# EAGLE design Charger_PCB (EAGLE 6.6.0)

## Sheet 1 of 2
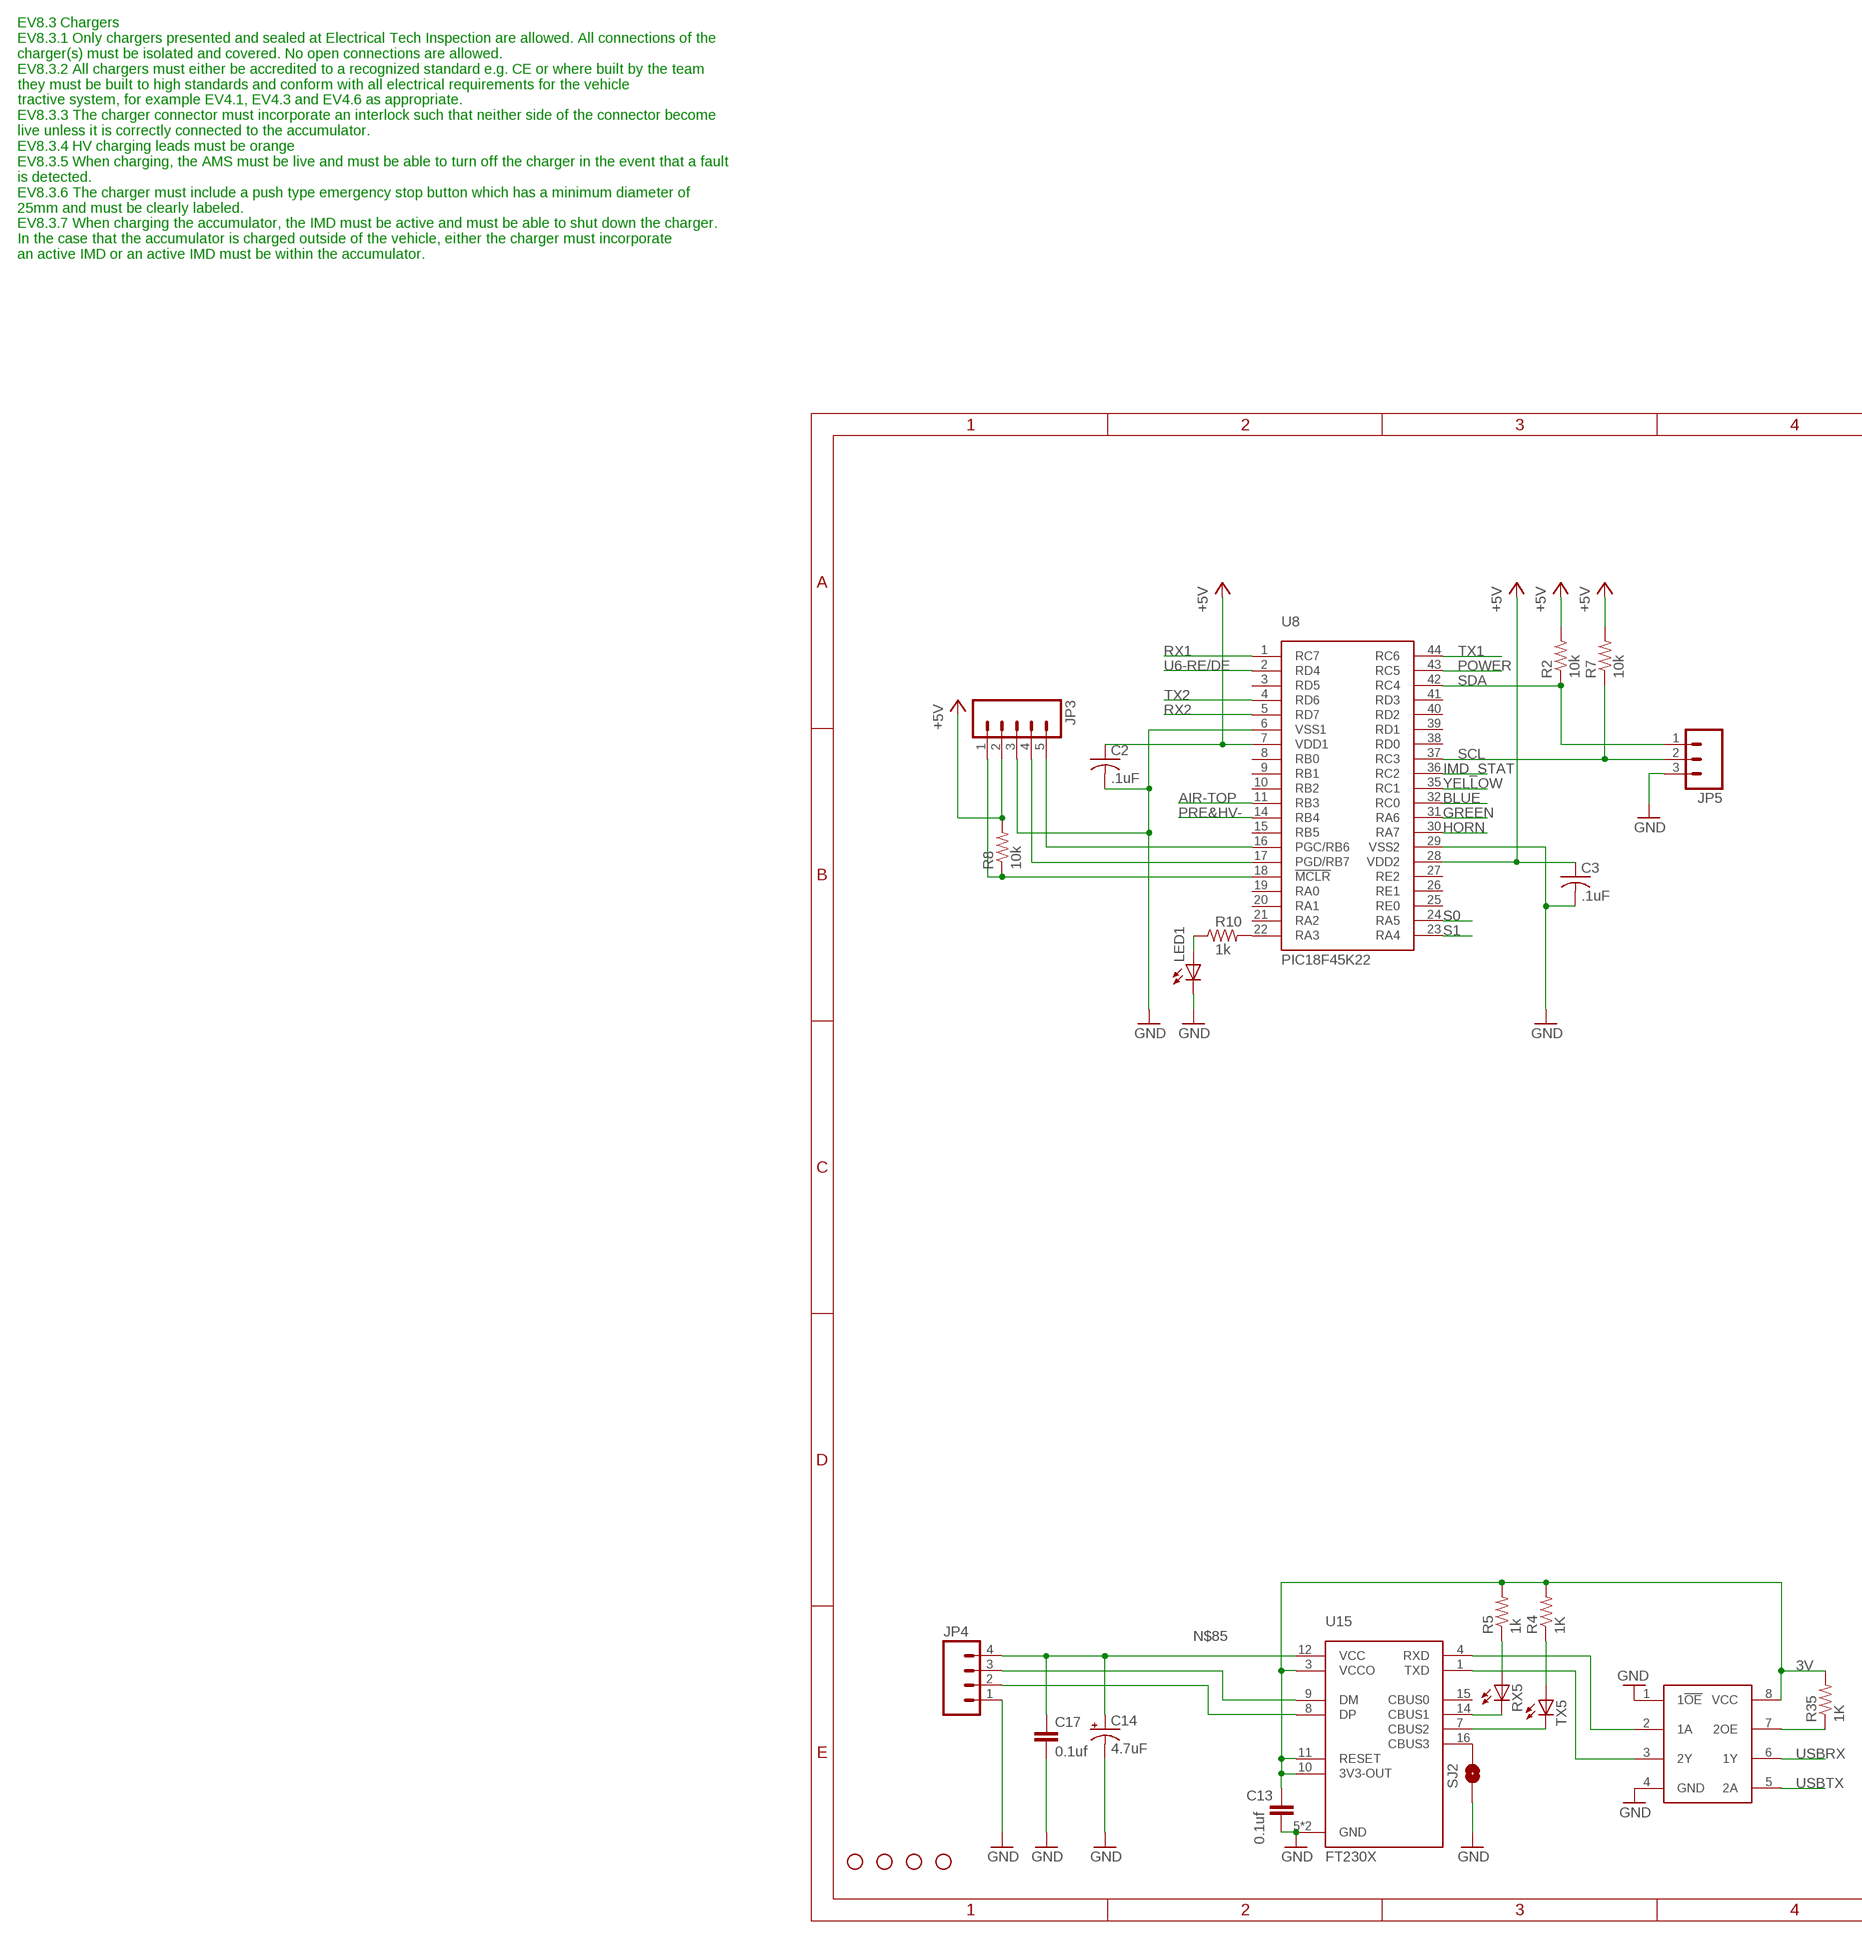
[diagram p0: schematic, sheet 1, part 1 of 2]
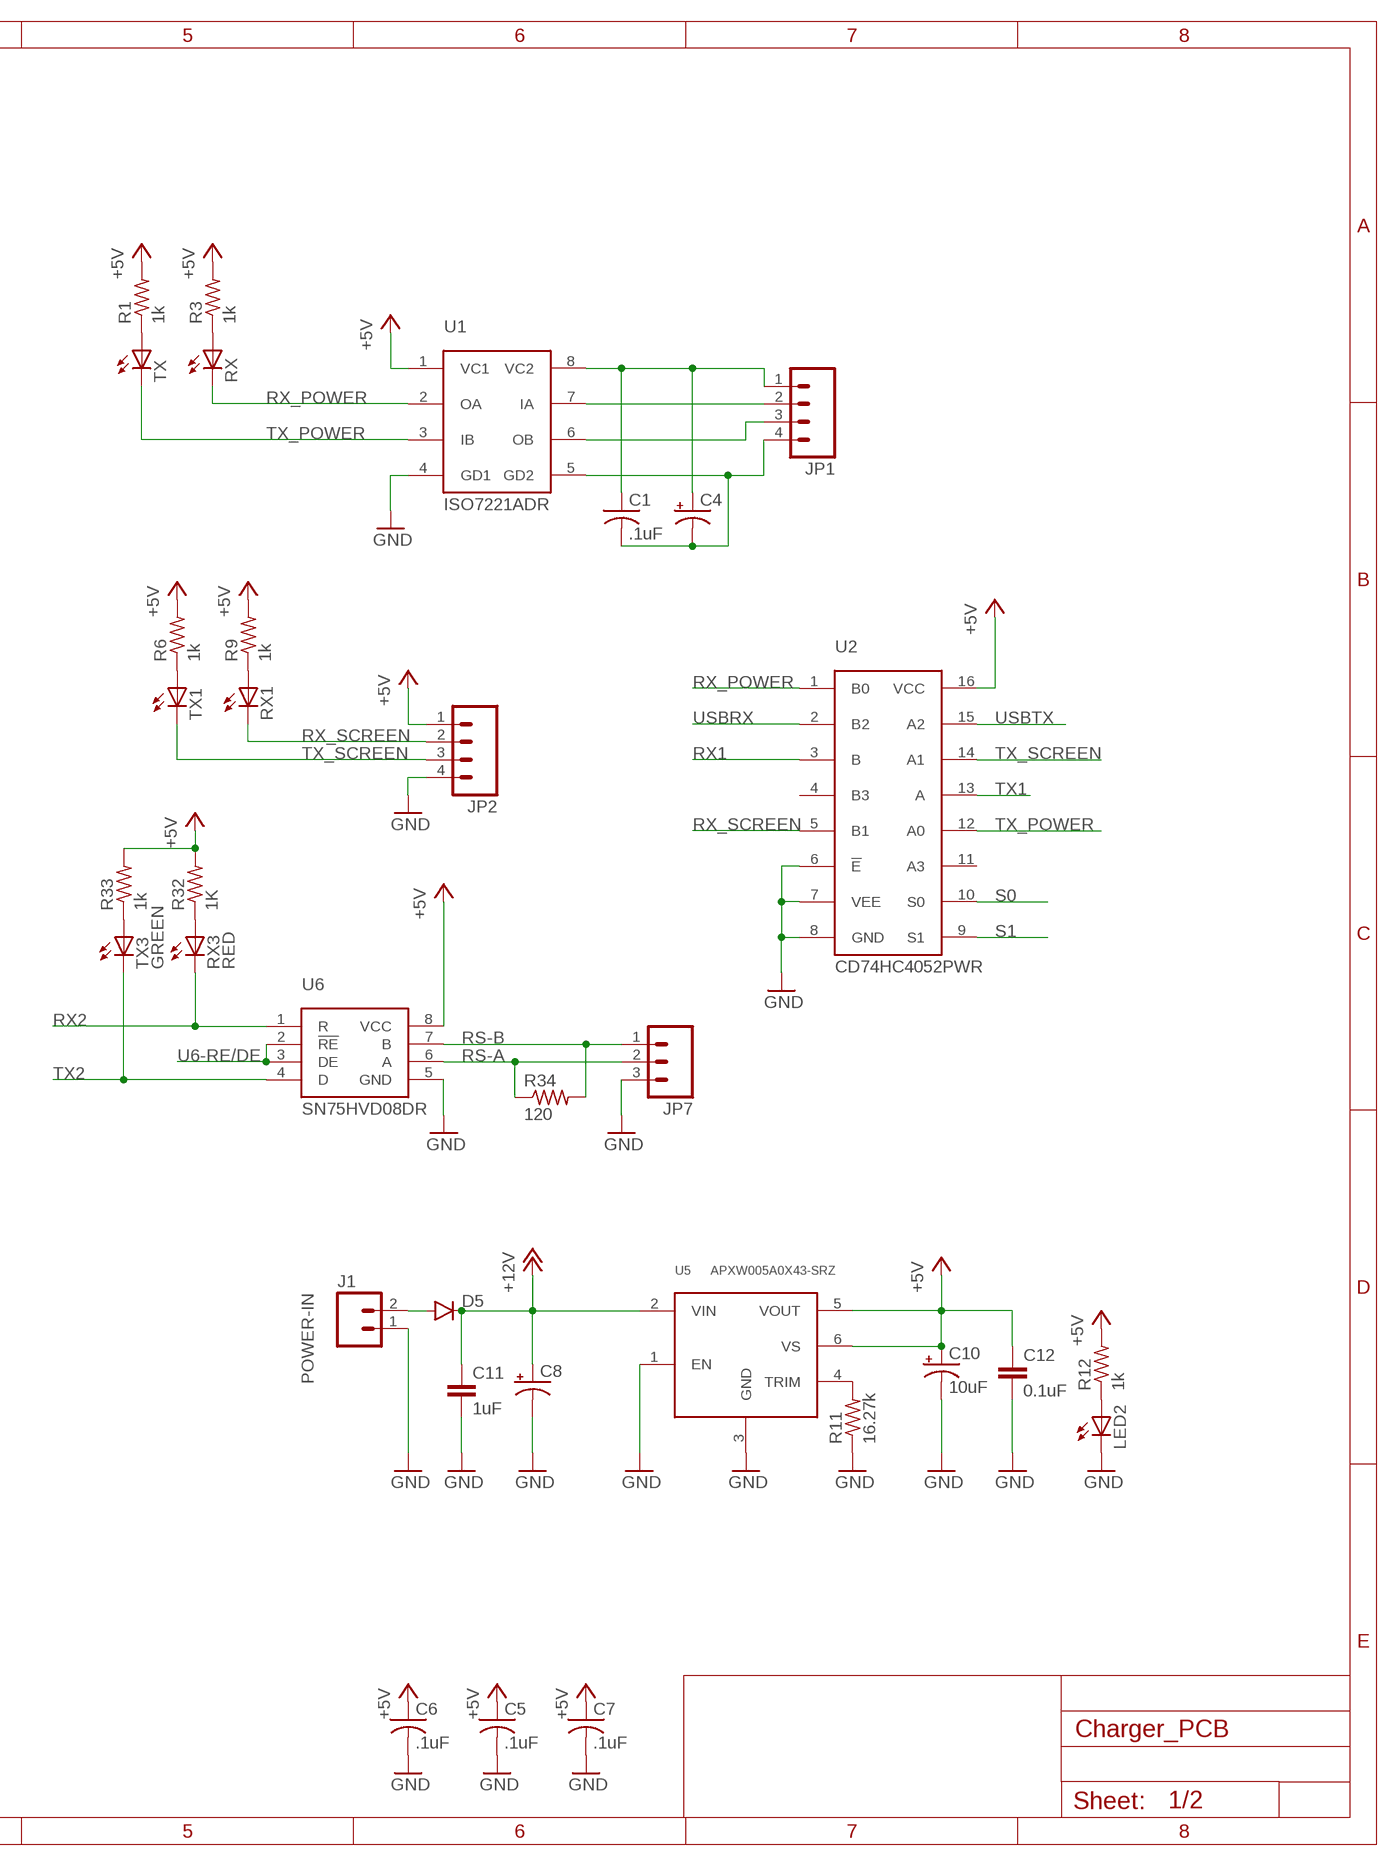
[diagram p1: schematic, sheet 1, part 2 of 2]

### Parts
C1  .1uF  C-USC0805  [C0805]
C2  .1uF  C-USC0805  [C0805]
C3  .1uF  C-USC0805  [C0805]
C4  CAP_POL1206-KIT  [EIA3216-KIT]
C5  .1uF  C-USC0805  [C0805]
C6  .1uF  C-USC0805  [C0805]
C7  .1uF  C-USC0805  [C0805]
C8  CAP_POLE  [PANASONIC_E]
C10  10uF  CAP_POL6032  [EIA6032]
C11  1uF  CAP1206  [1206]
C12  0.1uF  CAP0805  [0805]
C13  0.1uf  CAP0805  [0805]
C14  4.7uF  CAP_POL1206  [EIA3216]
C17  0.1uf  CAP0805  [0805]
D5  DIODEHV  [DIODE-HV]
J1  POWER-IN  EUROMAG-290DEG  [M2]
JP1  M04POLAR_LOCK  [MOLEX-1X4_LOCK]
JP2  M04POLAR_LOCK  [MOLEX-1X4_LOCK]
JP3  M05LOCK_LONGPADS  [1X05_LOCK_LONGPADS]
JP4  M04POLAR_LOCK  [MOLEX-1X4_LOCK]
JP5  M03POLAR_LOCK  [MOLEX-1X3_LOCK]
JP7  M03POLAR_LOCK  [MOLEX-1X3_LOCK]
LED1  LEDCHIP-LED0805  [CHIP-LED0805]
LED2  LEDCHIPLED_0805  [CHIPLED_0805]
R1  1k  R-US_R0805  [R0805]
R2  10k  R-US_R0805  [R0805]
R3  1k  R-US_R0805  [R0805]
R4  1K  R-US_R0805  [R0805]
R5  1k  R-US_R0805  [R0805]
R6  1k  R-US_R0805  [R0805]
R7  10k  R-US_R0805  [R0805]
R8  10k  RESISTOR0805-RES  [0805]
R9  1k  R-US_R0805  [R0805]
R10  1k  R-US_R0805  [R0805]
R11  16.27k  R-US_R0805  [R0805]
R12  1k  R-US_R0805  [R0805]
R32  1K  R-US_R0805  [R0805]
R33  1k  R-US_R0805  [R0805]
R34  120  R-US_R0805  [R0805]
R35  1K  R-US_R0805  [R0805]
RX  LEDCHIPLED_0805  [CHIPLED_0805]
RX1  LEDCHIPLED_0805  [CHIPLED_0805]
RX3  RED  LEDCHIPLED_0805  [CHIPLED_0805]
RX5  LEDCHIPLED_0805  [CHIPLED_0805]
SJ2  JUMPER-PAD-2-NOYES_SILK  [PAD-JUMPER-2-NO_YES_SILK]
STANDOFF1  STAND-OFF  [STAND-OFF]
STANDOFF2  STAND-OFF  [STAND-OFF]
STANDOFF3  STAND-OFF  [STAND-OFF]
STANDOFF4  STAND-OFF  [STAND-OFF]
TX  LEDCHIPLED_0805  [CHIPLED_0805]
TX1  LEDCHIPLED_0805  [CHIPLED_0805]
TX3  GREEN  LEDCHIPLED_0805  [CHIPLED_0805]
TX5  LEDCHIPLED_0805  [CHIPLED_0805]
U1  ISO7221ADR  [SO08]
U2  CD74HC4052PWR  [TSSOP-16]
U4  SN74LVC2G241DCTR  [VFSOP-8]
U5  APXW005A0X43-SRZ  [APXW005A0X43-SRZ]
U6  SN75HVD08DR  [SO-8]
U8  PIC18F45K22  [TQFP-44]
U15  FT230X  [SSOP-16]

### Nets
3V: C13.1 R4.2 R5.2 R35.2 U4.8(VCC) U15.3(VCCO) U15.10(3V3-OUT) U15.11(RESET)
+5V: C2.1 C3.1 C5.1 C6.1 C7.1 C10.P$1(+) C12.1 JP2.1 JP3.2 R1.2 R2.2 R3.2 R6.2 R7.2 R8.2 R9.2 R12.2 R32.2 R33.2 U1.1(VC1) U2.16(VCC) U5.5(VOUT) U5.6(VS) U6.8(VCC) U8.7(VDD1) U8.28(VDD2) ; also sheet 2
+12V: C8.+ C11.1 D5.C U5.2(VIN) ; also sheet 2
AIR-TOP: U8.11(RB3) ; also sheet 2
BLUE: U8.32(RC0) ; also sheet 2
GND: C2.2 C3.2 C5.2 C6.2 C7.2 C8.- C10.P$2(-) C11.2 C12.2 C13.2 C14.C(-) C17.2 J1.1 JP2.4 JP3.3 JP4.1 JP5.3 JP7.3 LED1.C LED2.C R11.1 SJ2.1 U1.4(GD1) U2.6(!E) U2.7(VEE) U2.8(GND) U4.1(1!OE) U4.4(GND) U5.1(EN) U5.3(GND) U6.5(GND) U8.6(VSS1) U8.29(VSS2) U15.5(GND) U15.13(GND) ; also sheet 2
GREEN: U8.31(RA6) ; also sheet 2
HORN: U8.30(RA7) ; also sheet 2
IMD_STAT: U8.36(RC2) ; also sheet 2
N$1: LED1.A R10.1
N$2: R10.2 U8.22(RA3)
N$3: C1.1 C4.A(+) JP1.1 U1.8(VC2)
N$4: JP1.2 U1.7(IA)
N$5: JP1.3 U1.6(OB)
N$6: C1.2 C4.C(-) JP1.4 U1.5(GD2)
N$7: R1.1 TX.A
N$8: R3.1 RX.A
N$9: R4.1 TX5.A
N$10: R5.1 RX5.A
N$11: R6.1 TX1.A
N$12: R9.1 RX1.A
N$16: R11.2 U5.4(TRIM)
N$19: LED2.A R12.1
N$35: R33.1 TX3.A
N$36: TX5.C U15.7(CBUS2)
N$37: R32.1 RX3.A
N$38: RX5.C U15.14(CBUS1)
N$39: U4.2(1A) U15.4(RXD)
N$40: JP3.4 U8.17(PGD/RB7)
N$41: U4.3(2Y) U15.1(TXD)
N$42: JP4.3 U15.9(DM)
N$43: JP3.5 U8.16(PGC/RB6)
N$45: D5.A J1.2
N$46: JP3.1 R8.1 U8.18(!MCLR)
N$54: JP4.2 U15.8(DP)
N$62: SJ2.2 U15.16(CBUS3)
N$69: R35.1 U4.7(2OE)
N$85: C14.A(+) C17.1 JP4.4 U15.12(VCC)
POWER: U8.43(RC5) ; also sheet 2
PRE&HV-: U8.14(RB4) ; also sheet 2
RS-A: JP7.2 R34.1 U6.6(A)
RS-B: JP7.1 R34.2 U6.7(B)
RX1: U2.3(B) U8.1(RC7)
RX2: RX3.C U6.1(R) U8.5(RD7)
RX_POWER: RX.C U1.2(OA) U2.1(B0)
RX_SCREEN: JP2.2 RX1.C U2.5(B1)
S0: U2.10(S0) U8.24(RA5)
S1: U2.9(S1) U8.23(RA4)
SCL: JP5.2 R7.1 U8.37(RC3)
SDA: JP5.1 R2.1 U8.42(RC4)
TX1: U2.13(A) U8.44(RC6)
TX2: TX3.C U6.4(D) U8.4(RD6)
TX_POWER: TX.C U1.3(IB) U2.12(A0)
TX_SCREEN: JP2.3 TX1.C U2.14(A1)
U6-RE/DE: U6.2(!RE) U6.3(DE) U8.2(RD4)
USBRX: U2.2(B2) U4.6(1Y)
USBTX: U2.15(A2) U4.5(2A)
YELLOW: U8.35(RC1) ; also sheet 2
Unconnected: U2.4(B3) U2.11(A3) U8.3(RD5) U8.8(RB0) U8.9(RB1) U8.10(RB2) U8.15(RB5) U8.19(RA0) U8.20(RA1) U8.21(RA2) U8.25(RE0) U8.26(RE1) U8.27(RE2) U8.38(RD0) U8.39(RD1) U8.40(RD2) U8.41(RD3) U15.15(CBUS0)

### Notes on the sheet
- EV8.3 Chargers
  EV8.3.1 Only chargers presented and sealed at Electrical Tech Inspection are allowed. All connections of the 
  charger(s) must be isolated and covered. No open connections are allowed.
  EV8.3.2 All chargers must either be accredited to a recognized standard e.g. CE or where built by the team 
  they must be built to high standards and conform with all electrical requirements for the vehicle 
  tractive system, for example EV4.1, EV4.3 and EV4.6 as appropriate.
  EV8.3.3 The charger connector must incorporate an interlock such that neither side of the connector become 
  live unless it is correctly connected to the accumulator.
  EV8.3.4 HV charging leads must be orange
  EV8.3.5 When charging, the AMS must be live and must be able to turn off the charger in the event that a fault 
  is detected.
  EV8.3.6 The charger must include a push type emergency stop button which has a minimum diameter of 
  25mm and must be clearly labeled.
  EV8.3.7 When charging the accumulator, the IMD must be active and must be able to shut down the charger. 
  In the case that the accumulator is charged outside of the vehicle, either the charger must incorporate 
  an active IMD or an active IMD must be within the accumulator.

## Sheet 2 of 2
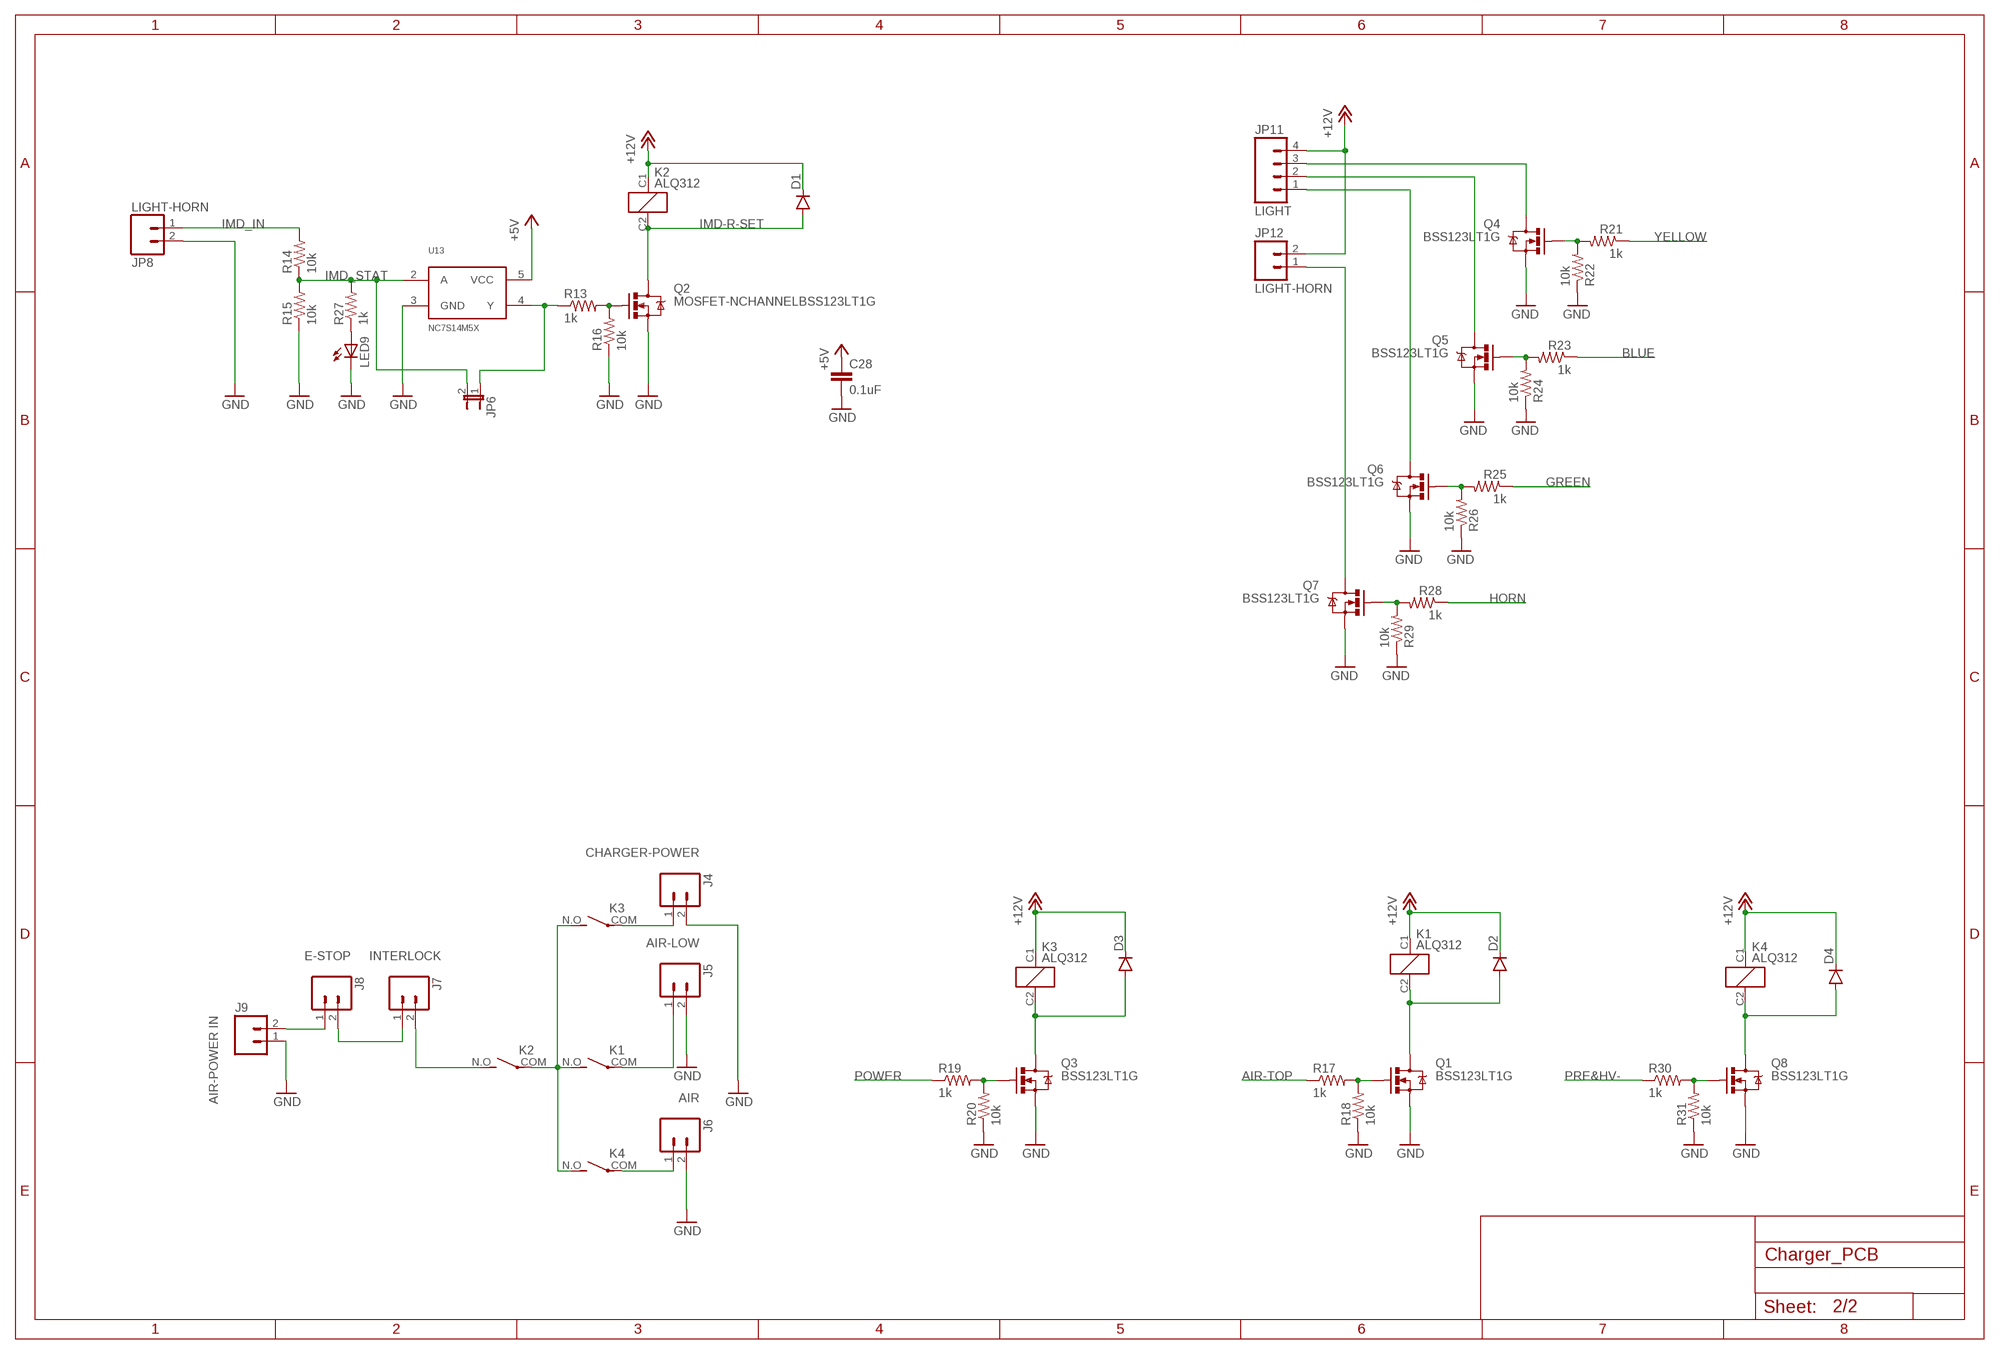
[diagram p2: schematic, sheet 2]

### Parts
C28  0.1uF  CAP0805  [0805]
D1  DIODEHV  [DIODE-HV]
D2  DIODEHV  [DIODE-HV]
D3  DIODEHV  [DIODE-HV]
D4  DIODEHV  [DIODE-HV]
J4  CHARGER-POWER  EUROMAG-290DEG  [M2]
J5  AIR-LOW  EUROMAG-290DEG  [M2]
J6  AIR  EUROMAG-290DEG  [M2]
J7  INTERLOCK  EUROMAG-290DEG  [M2]
J8  E-STOP  EUROMAG-290DEG  [M2]
J9  AIR-POWER IN  EUROMAG-290DEG  [M2]
JP6  JUMPER-2SMD-NO  [SJ_2S-NO]
JP8  LIGHT-HORN  M02POLAR_LOCK  [MOLEX-1X2_LOCK]
JP11  LIGHT  M04POLAR_LOCK  [MOLEX-1X4_LOCK]
JP12  LIGHT-HORN  M02POLAR_LOCK  [MOLEX-1X2_LOCK]
K1  ALQ312  [ALQ312]
K2  ALQ312  [ALQ312]
K3  ALQ312  [ALQ312]
K4  ALQ312  [ALQ312]
LED9  LEDCHIPLED_0805  [CHIPLED_0805]
Q1  BSS123LT1G  MOSFET-NCHANNELBSS123LT1G  [SOT23]
Q2  MOSFET-NCHANNELBSS123LT1G  [SOT23]
Q3  BSS123LT1G  MOSFET-NCHANNELBSS123LT1G  [SOT23]
Q4  BSS123LT1G  MOSFET-NCHANNELBSS123LT1G  [SOT23]
Q5  BSS123LT1G  MOSFET-NCHANNELBSS123LT1G  [SOT23]
Q6  BSS123LT1G  MOSFET-NCHANNELBSS123LT1G  [SOT23]
Q7  BSS123LT1G  MOSFET-NCHANNELBSS123LT1G  [SOT23]
Q8  BSS123LT1G  MOSFET-NCHANNELBSS123LT1G  [SOT23]
R13  1k  RESISTOR0805-RES  [0805]
R14  10k  RESISTOR0805-RES  [0805]
R15  10k  RESISTOR0805-RES  [0805]
R16  10k  RESISTOR0805-RES  [0805]
R17  1k  RESISTOR0805-RES  [0805]
R18  10k  RESISTOR0805-RES  [0805]
R19  1k  RESISTOR0805-RES  [0805]
R20  10k  RESISTOR0805-RES  [0805]
R21  1k  RESISTOR0805-RES  [0805]
R22  10k  RESISTOR0805-RES  [0805]
R23  1k  RESISTOR0805-RES  [0805]
R24  10k  RESISTOR0805-RES  [0805]
R25  1k  RESISTOR0805-RES  [0805]
R26  10k  RESISTOR0805-RES  [0805]
R27  1k  RESISTOR0805-RES  [0805]
R28  1k  RESISTOR0805-RES  [0805]
R29  10k  RESISTOR0805-RES  [0805]
R30  1k  RESISTOR0805-RES  [0805]
R31  10k  RESISTOR0805-RES  [0805]
U13  NC7S14M5X  [SOT23-5]

### Nets
+5V: C28.1 U13.5(VCC) ; also sheet 1
+12V: D1.C D2.C D3.C D4.C JP11.4 JP12.2 K1.C1(+) K2.C1(+) K3.C1(+) K4.C1(+) ; also sheet 1
AIR-TOP: R17.1 ; also sheet 1
BLUE: R23.1 ; also sheet 1
GND: C28.2 J4.2 J5.2 J6.2 J9.1 JP8.2 LED9.C Q1.2(S) Q2.2(S) Q3.2(S) Q4.2(S) Q5.2(S) Q6.2(S) Q7.2(S) Q8.2(S) R15.1 R16.1 R18.1 R20.1 R22.1 R24.1 R26.1 R29.1 R31.1 U13.3(GND) ; also sheet 1
GREEN: R25.1 ; also sheet 1
HORN: R28.1 ; also sheet 1
IMD-R-SET: D1.A K2.C2(-) Q2.3(D)
IMD-R-SET1: D2.A K1.C2(-) Q1.3(D)
IMD-R-SET2: D3.A K3.C2(-) Q3.3(D)
IMD-R-SET3: D4.A K4.C2(-) Q8.3(D)
IMD_IN: JP8.1 R14.2
IMD_STAT: JP6.2 R14.1 R15.2 R27.2 U13.2(A) ; also sheet 1
N$13: K1.N.O(S) K2.COM(P) K3.N.O(S) K4.N.O(S)
N$14: Q2.1(G) R13.2 R16.2
N$15: Q8.1(G) R30.2 R31.2
N$17: J8.1 J9.2
N$18: J7.1 J8.2
N$20: J4.1 K3.COM(P)
N$21: Q4.1(G) R21.2 R22.2
N$22: J6.1 K4.COM(P)
N$23: Q1.1(G) R17.2 R18.2
N$24: Q3.1(G) R19.2 R20.2
N$25: Q5.1(G) R23.2 R24.2
N$26: Q6.1(G) R25.2 R26.2
N$27: Q7.1(G) R28.2 R29.2
N$28: JP11.3 Q4.3(D)
N$29: JP11.2 Q5.3(D)
N$30: JP11.1 Q6.3(D)
N$31: JP6.1 R13.1 U13.4(Y)
N$32: LED9.A R27.1
N$33: JP12.1 Q7.3(D)
N$34: J5.1 K1.COM(P)
N$44: J7.2 K2.N.O(S)
POWER: R19.1 ; also sheet 1
PRE&HV-: R30.1 ; also sheet 1
YELLOW: R21.1 ; also sheet 1

## Library data of the parts
C1-C3 C5-C7 = adafruit:C-US: CAPACITOR, American symbol
C4 = SparkFun-Passives:CAP_POL: Capacitor Polarized These are standard SMD and PTH capacitors. Normally 10uF, 47uF, and 100uF in electrolytic and tantalum varieties. Always verify the external diameter of the through hole cap, it varies with capacity, voltage, and manufacturer. The EIA devices should be standard.
C8 C10 = SparkFun-Capacitors:CAP_POL: Capacitor Polarized These are standard SMD and PTH capacitors. Normally 10uF, 47uF, and 100uF in electrolytic and tantalum varieties. Always verify the external diameter of the through hole cap, it varies with capacity, voltage, and manufacturer. The EIA devices should be standard.
C11 C12 = SparkFun-Capacitors:CAP: Capacitor Standard 0603 ceramic capacitor, and 0.1" leaded capacitor.
C13 C17 = SparkFun:CAP: Capacitor Standard 0603 ceramic capacitor, and 0.1" leaded capacitor.
C14 = SparkFun:CAP_POL: Capacitor Polarized These are standard SMD and PTH capacitors. Normally 10uF, 47uF, and 100uF in electrolytic and tantalum varieties. Always verify the external diameter of the through hole cap, it varies with capacity, voltage, and manufacturer. The EIA devices should be standard.
C28 = SparkFun-Passives:CAP: Capacitor Standard 0603 ceramic capacitor, and 0.1" leaded capacitor.
D1-D5 = SparkFun-DiscreteSemi:DIODE: Diode These are standard reverse protection diodes and small signal diodes. SMA package can handle up to about 1A. SOD-323 can handle about 200mA. What the SOD-323 package when ordering, there are some mfgs out there that are 5-pin packages.
J1 J4-J9 = NASA_LIB:EUROMAG-2
JP1 JP2 JP4 JP11 = SparkFun-Connectors:M04: Header 4 Standard 4-pin 0.1" header. Use with straight break away headers (SKU : PRT-00116), right angle break away headers (PRT-00553), swiss pins (PRT-00743), machine pins (PRT-00117), and female headers (PRT-00115). Molex polarized connector foot print use with SKU : PRT-08231 with associated crimp pins and housings. 1MM SMD Version SKU: PRT-10208
JP3 = SparkFun-Connectors:M05: Header 5 Standard 5-pin 0.1" header. Use with straight break away headers (SKU : PRT-00116), right angle break away headers (PRT-00553), swiss pins (PRT-00743), machine pins (PRT-00117), and female headers (PRT-00115). Molex polarized connector foot print use with SKU : PRT-08230 with associated crimp pins and housings.
JP5 JP7 = SparkFun-Connectors:M03: Header 3 Standard 3-pin 0.1" header. Use with straight break away headers (SKU : PRT-00116), right angle break away headers (PRT-00553), swiss pins (PRT-00743), machine pins (PRT-00117), and female headers (PRT-00115). Molex polarized connector foot print use with SKU : PRT-08232 with associated crimp pins and housings.
JP6 = SparkFun-Passives:JUMPER-2: Jumper Basic 0.1" spaced jumper. Use with breakaway headers.
JP8 JP12 = SparkFun-Connectors:M02: Standard 2-pin 0.1" header. Use with - straight break away headers ( PRT-00116) - right angle break away headers (PRT-00553) - swiss pins (PRT-00743) - machine pins (PRT-00117) - female headers (PRT-00115) Molex polarized connector foot print use with: PRT-08233 with associated crimp pins and housings. 2.54_SCREWTERM for use with PRT-10571. 3.5mm Screw Terminal footprints for PRT-08084 5mm Screw Terminal footprints for use with PRT-08432
K1-K3 = FSAE Eletric (2):ALQ312
K4 = FSAE Eletric:ALQ312
LED1 LED2 LED9 RX RX1 RX3 RX5 TX TX1 TX3 TX5 = adafruit:LED: LED OSRAM: - CHIPLED LG R971, LG N971, LY N971, LG Q971, LY Q971, LO R971, LY R971 LH N974, LH R974 LS Q976, LO Q976, LY Q976 LO Q996 - Hyper CHIPLED LW Q18S LB Q993, LB Q99A, LB R99A - SideLED LS A670, LO A670, LY A670, LG A670, LP A670 LB A673, LV A673, LT A673, LW A673 LH A674 LY A675 LS A676, LA A676, LO A676, LY A676, LW A676 LS A679, LY A679, LG A679 - Hyper Micro SIDELED® LS Y876, LA Y876, LO Y876, LY Y876 LT Y87S - SmartLED LW L88C, LW L88S LB L89C, LB L89S, LG L890 LS L89K, LO L89K, LY L89K LS L896, LA L896, LO L896, LY L896 - TOPLED LS T670, LO T670, LY T670, LG T670, LP T670 LSG T670, LSP T670, LSY T670, LOP T670, LYG T670 LG T671, LOG T671, LSG T671 LB T673, LV T673, LT T673, LW T673 LH T674 LS T676, LA T676, LO T676, LY T676, LB T676, LH T676, LSB T676, LW T676 LB T67C, LV T67C, LT T67C, LS T67K, LO T67K, LY T67K, LW E67C LS E67B, LA E67B, LO E67B, LY E67B, LB E67C, LV E67C, LT E67C LW T67C LS T679, LY T679, LG T679 LS T770, LO T770, LY T770, LG T770, LP T770 LB T773, LV T773, LT T773, LW T773 LH T774 LS E675, LA E675, LY E675, LS T675 LS T776, LA T776, LO T776, LY T776, LB T776 LHGB T686 LT T68C, LB T68C - Hyper Mini TOPLED® LB M676 - Mini TOPLED Santana® LG M470 LS M47K, LO M47K, LY M47K Source: http://www.osram.convergy.de/
Q1-Q8 = SparkFun-DiscreteSemi:MOSFET-NCHANNEL: Common NMOSFET Parts MFG P/N Store ID Prod ID FDD8780 TRANS-09984 SI7820DN TRANS-11055 FDS6630A IC-08089 2N7002PW TRANS-11151 FQP30N06L COM-10213 TRANS-10060 BSS123LT1G TRANS-08345 BSS138 TRANS-00830 BS170 2N7000; PROD_ID: TRANS-08345
R1-R7 R9-R12 R32-R35 = adafruit:R-US_: RESISTOR, American symbol
R8 R13-R31 = SparkFun-Passives:RESISTOR: Resistor Basic schematic elements and footprints for 0603, 1206, and PTH resistors.
SJ2 = SparkFun-Passives:JUMPER-PAD-2-NO
STANDOFF1-STANDOFF4 = SparkFun-Electromechanical:STAND-OFF: #4 Stand Off This is the mechanical footprint for a #4 phillips button head screw. Use the keepout ring to avoid running the screw head into surrounding components. SKU : PRT-00447
U1 = NASA_LIB:ISO7221ADR
U2 = NASA_LIB:CD74HC4052PWR
U4 = Cleaverbrooks:SN74LVC2G241DCTR
U5 = NASA_LIB:APXW005A0X43-SRZ
U6 = FSAE Eletric:SN75HVD08DR
U8 = FSAE Eletric:PIC18F45K22
U13 = FSAE Eletric:NC7S14M5X
U15 = FSAE Eletric:FT230X

## Board
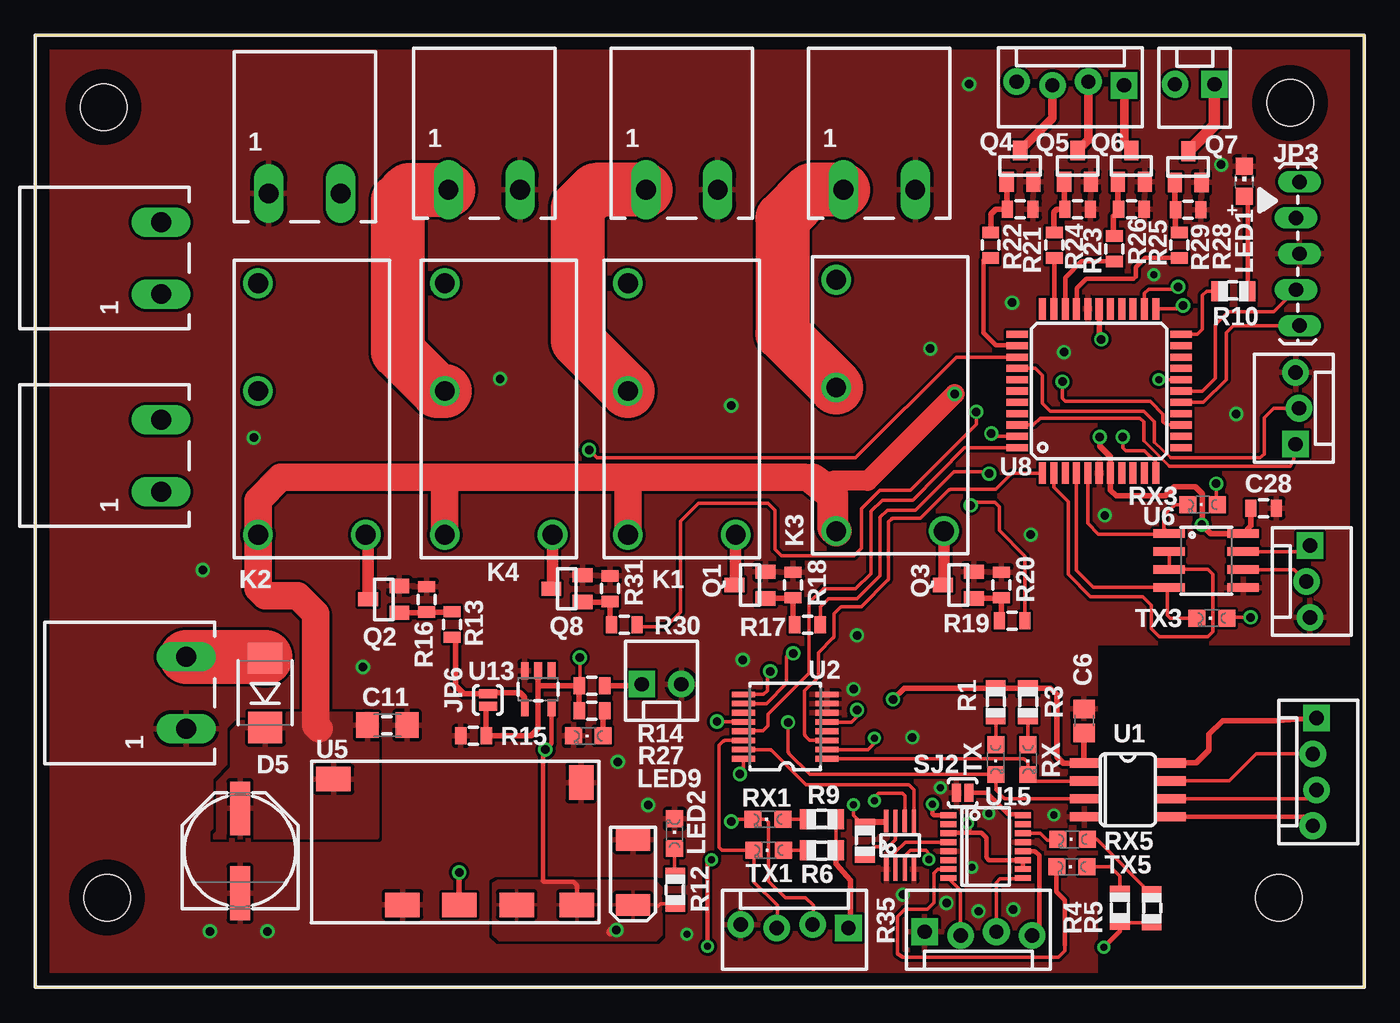
[diagram p3: board, top side]
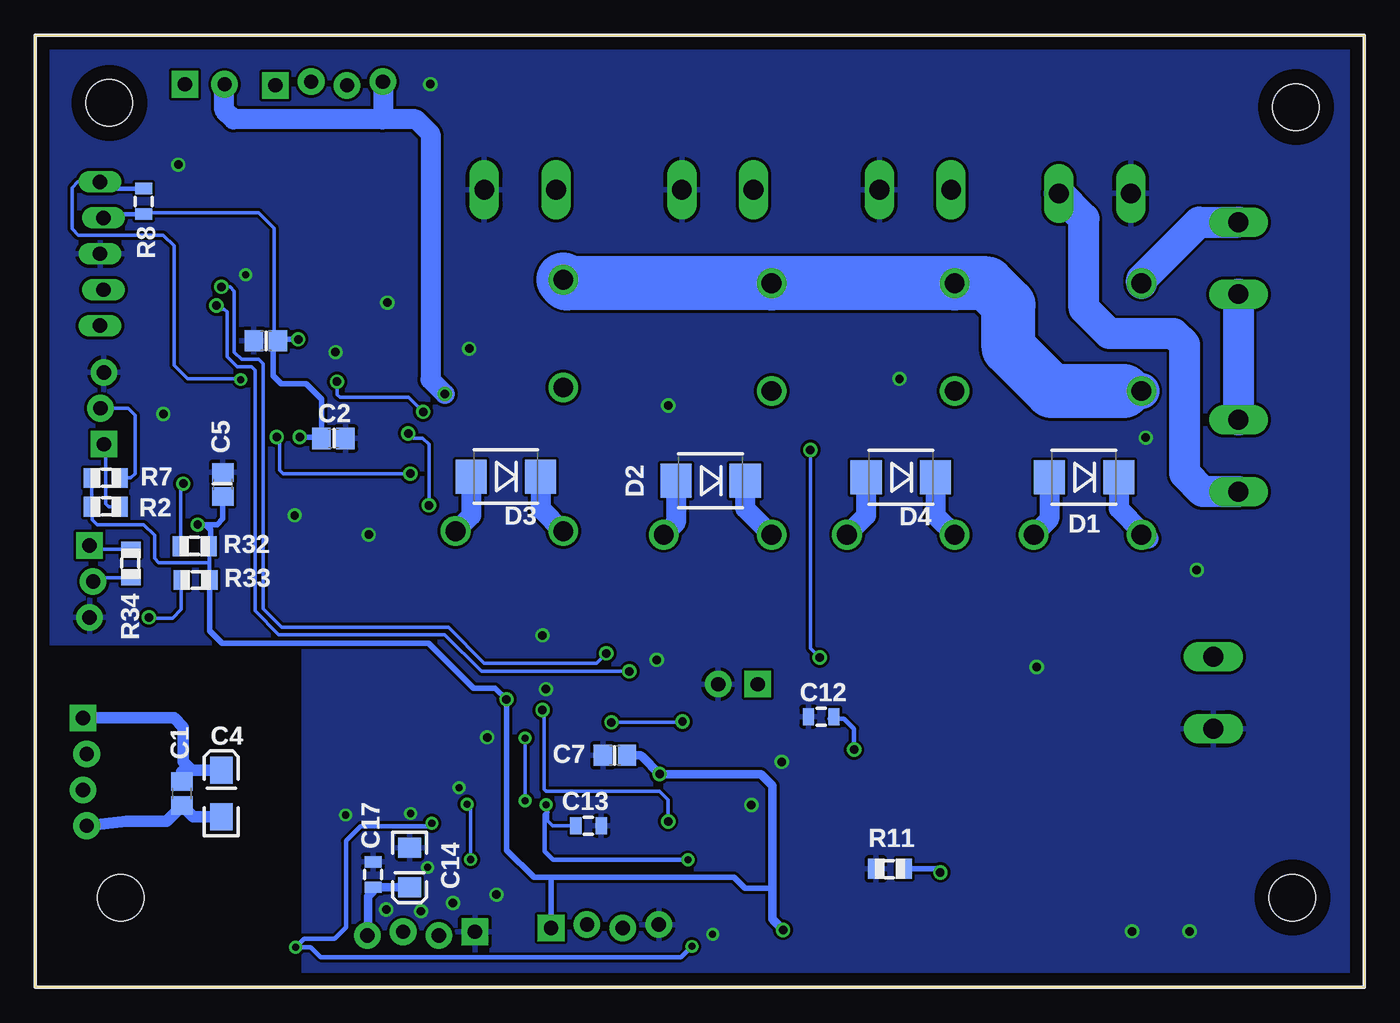
[diagram p4: board, bottom side, seen from below]

Size 93.98 x 67.31 mm. Coordinates in mm from the lower left corner, seen from the top.
Outline: 0,0 93.98,0 93.98,67.31 0,67.31 0,0
Copper layers (1*16): Top 0.035mm / dielectric 1.5mm / Bottom 0.035mm
Design rules "default": minimum track width 10mil, minimum drill 24mil, track to track 8mil, track to pad 8mil, pad to pad 8mil, via to via 8mil, smd to smd 8mil, copper to edge 40mil, drill to drill 8mil, minimum pad ring 10mil, minimum via ring 8mil, stop-mask expansion 4mil, vias tented up to drill 0mil, thermal gap 10mil

### Footprints (pad centres in the part's own frame; a part is rotated, then mirrored left to right if it is on the bottom)
C0805 = smd 1.3 x 1.5: 1 -0.85,0; 2 0.85,0
EIA3216-KIT = smd 1.9 x 1.6: A 1.65,0; C -1.65,0
PANASONIC_E = smd 3.8 x 1.4: + 3,0; - -3,0
EIA6032 = smd 1.5 x 2.4: P$1 -2.3,0; P$2 2.3,0
1206 = smd 1.6 x 1.8: 1 -1.4,0; 2 1.4,0
0805 = smd 0.8 x 1.2: 1 -0.9,0; 2 0.9,0
EIA3216 = smd 1.4 x 1.6: A 1.4,0; C -1.4,0
DIODE-HV = smd 2.2 x 2.4: A 2.454,0; C -2.454,0
M2 = drill 1.4 long: 1 -2.54,0; 2 2.54,0
MOLEX-1X4_LOCK = drill 1.016 pad 1.88 square: 1 0,0.127 | drill 1.016 pad 1.88: 2 2.54,-0.127; 3 5.08,0.127; 4 7.62,-0.127
1X05_LOCK_LONGPADS = drill 1.016 long: 1 0,0; 2 2.54,-0.254; 3 5.08,0; 4 7.62,-0.254; 5 10.16,0
MOLEX-1X3_LOCK = drill 1.016 pad 1.88 square: 1 0,0.127 | drill 1.016 pad 1.88: 2 2.54,-0.127; 3 5.08,0.127
SJ_2S-NO = smd 0.635 x 1.27: 1 -0.45,0; 2 0.45,0
MOLEX-1X2_LOCK = drill 1.016 pad 1.88 square: 1 -0.127,0 | drill 1.016 pad 1.88: 2 2.667,0
ALQ312 = drill 1.4: C1 -8.89,3.81; C2 -8.89,-3.81; COM 1.27,3.81; N.O 8.89,3.81
CHIP-LED0805 = smd 1.2 x 1.2: A 0,-1.05; C 0,1.05
CHIPLED_0805 = smd 1.2 x 1.2: A 0,-1.05; C 0,1.05
SOT23 = smd 1 x 1.4: 1 -0.95,-1.1; 2 0.95,-1.1; 3 0,1.1
R0805 = smd 1.1 x 1.4: 1 -1,0; 2 1,0
PAD-JUMPER-2-NO_YES_SILK = smd 0.635 x 1.27: 1 -0.45,0; 2 0.45,0
STAND-OFF = hole 3.302: 0,0
SO08 = smd 0.66 x 2.032: 1 -1.905,-3.073; 2 -0.635,-3.073; 3 0.635,-3.073; 4 1.905,-3.073; 5 1.905,3.073; 6 0.635,3.073; 7 -0.635,3.073; 8 -1.905,3.073
TSSOP-16 = smd 0.4 x 1.6: 1 -2.225,-2.85; 2 -1.575,-2.85; 3 -0.925,-2.85; 4 -0.275,-2.85; 5 0.375,-2.85; 6 1.025,-2.85; 7 1.675,-2.85; 8 2.325,-2.85; 9 2.325,3.05; 10 1.675,3.05; 11 1.025,3.05; 12 0.375,3.05; 13 -0.275,3.05; 14 -0.925,3.05; 15 -1.575,3.05; 16 -2.225,3.05
VFSOP-8 = smd 0.3 x 1.6: 1 -0.98,-1.7; 2 -0.33,-1.7; 3 0.33,-1.7; 4 0.98,-1.7; 5 0.97,1.69; 6 0.325,1.7; 7 -0.33,1.7; 8 -0.98,1.71
APXW005A0X43-SRZ = smd 1.73 x 2.44: 1 1.28,1.52 | smd 2.44 x 1.73: 2 18.796,1.27; 3 13.92,10.16; 4 9.906,10.16; 5 5.842,10.16; 6 1.574,10.16
SO-8 = smd 0.61 x 2.21: 1 -1.905,-2.616; 2 -0.635,-2.616; 3 0.635,-2.616; 4 1.905,-2.616; 5 1.905,2.616; 6 0.635,2.616; 7 -0.635,2.616; 8 -1.905,2.616
TQFP-44 = smd 1.5 x 0.5: 1 -5.8,4; 2 -5.8,3.2; 3 -5.8,2.4; 4 -5.8,1.6; 5 -5.8,0.8; 6 -5.8,0; 7 -5.8,-0.8; 8 -5.8,-1.6; 9 -5.8,-2.4; 10 -5.8,-3.2; 11 -5.8,-4; 23 5.8,-4; 24 5.8,-3.2; 25 5.8,-2.4; 26 5.8,-1.6; 27 5.8,-0.8; 28 5.8,0; 29 5.8,0.8; 30 5.8,1.6; 31 5.8,2.4; 32 5.8,3.2; 33 5.8,4 | smd 0.5 x 1.5: 12 -4,-5.8; 13 -3.2,-5.8; 14 -2.4,-5.8; 15 -1.6,-5.8; 16 -0.8,-5.8; 17 0,-5.8; 18 0.8,-5.8; 19 1.6,-5.8; 20 2.4,-5.8; 21 3.2,-5.8; 22 4,-5.8; 34 4,5.8; 35 3.2,5.8; 36 2.4,5.8; 37 1.6,5.8; 38 0.8,5.8; 39 0,5.8; 40 -0.8,5.8; 41 -1.6,5.8; 42 -2.4,5.8; 43 -3.2,5.8; 44 -4,5.8
SOT23-5 = smd 0.55 x 1.2: 1 -0.95,-1.3; 2 0,-1.3; 3 0.95,-1.3; 4 0.95,1.3; 5 -0.95,1.3
SSOP-16 = smd 0.419 x 1.143: 1 -2.223,-2.642; 2 -1.587,-2.642; 3 -0.953,-2.642; 4 -0.318,-2.642; 5 0.318,-2.642; 6 0.953,-2.642; 7 1.587,-2.642; 8 2.223,-2.642; 9 2.223,2.642; 10 1.587,2.642; 11 0.953,2.642; 12 0.318,2.642; 13 -0.318,2.642; 14 -0.953,2.642; 15 -1.587,2.642; 16 -2.223,2.642

### Placement (x,y rotation side)
C1  83.62,13.72 270 bottom
C2  72.9,38.81 0 bottom
C3  77.67,45.72 180 bottom
C4  80.82,13.72 90 bottom
C5  80.72,35.56 90 bottom
C6  74.17,18.85 90 top
C7  52.98,16.41 180 bottom
C8  14.48,9.65 90 top
C10  42.27,8.13 90 top
C11  24.89,18.54 0 top
C12  38.4,19.15 180 bottom
C13  54.86,11.43 0 bottom
C14  67.51,8.48 270 bottom
C17  70.1,7.98 90 bottom
C28  86.87,33.88 0 top
D1  19.81,36.07 180 bottom
D2  46.23,35.81 180 bottom
D3  60.71,36.12 180 bottom
D4  32.77,36.07 180 bottom
D5  16.26,20.83 90 top
J1  10.67,20.83 90 top
J4  59.69,56.39 0 top
J5  45.72,56.39 0 top
J6  31.75,56.39 0 top
J7  8.89,51.56 90 top
J8  8.89,37.59 90 top
J9  19.05,56.13 0 top
JP1  90.47,19.05 270 top
JP2  57.51,4.32 180 top
JP3  89.41,56.95 270 top
JP4  62.89,3.81 0 top
JP5  89.26,38.4 90 top
JP6  32,20.32 270 top
JP7  90.02,31.24 270 top
JP8  43.03,21.44 0 top
JP11  77.01,63.91 180 top
JP12  83.26,63.86 180 top
K1  45.72,40.89 90 top
K2  19.56,40.89 90 top
K3  60.45,41.15 90 top
K4  32.77,40.89 90 top
LED1  85.5,57 0 top
LED2  45.21,10.87 0 top
LED9  39.12,17.78 90 top
Q1  50.55,28.45 90 top
Q2  24.64,27.43 90 top
Q3  65.28,28.45 90 top
Q4  69.65,58.06 0 top
Q5  73.71,58.06 0 top
Q6  77.52,58.06 0 top
Q7  81.53,58.01 0 top
Q8  37.59,28.19 90 top
R1  67.92,20.17 90 top
R2  89,33.99 180 bottom
R3  70.21,20.17 90 top
R4  76.71,5.64 270 top
R5  78.94,5.59 270 top
R6  55.63,9.7 0 top
R7  89,36.02 180 bottom
R8  86.31,55.58 270 bottom
R9  55.63,11.89 0 top
R10  84.73,49.23 180 top
R11  33.53,8.38 0 bottom
R12  45.26,6.91 270 top
R13  29.46,25.65 90 top
R14  39.37,21.34 0 top
R15  30.99,17.78 0 top
R16  27.69,27.43 270 top
R17  54.61,25.65 180 top
R18  53.59,28.45 270 top
R19  69.09,25.91 180 top
R20  68.33,28.45 270 top
R21  67.56,52.48 90 top
R22  69.65,55.02 180 top
R23  72.09,52.48 90 top
R24  73.71,55.02 180 top
R25  76.3,52.22 90 top
R26  77.52,55.02 180 top
R27  39.37,19.56 180 top
R28  80.92,52.48 90 top
R29  81.53,54.97 180 top
R30  41.66,25.65 180 top
R31  40.64,28.19 270 top
R32  82.7,31.19 0 bottom
R33  82.65,28.8 0 bottom
R34  87.22,29.97 90 bottom
R35  58.67,10.36 90 top
RX  70.21,16.1 180 top
RX1  51.82,11.89 90 top
RX3  82.55,34.14 90 top
RX5  73.36,10.46 90 top
SJ2  65.58,13.77 0 top
STANDOFF1  88.75,62.53 0 top
STANDOFF2  4.83,62.23 0 top
STANDOFF3  87.93,6.35 0 top
STANDOFF4  5.08,6.35 0 top
TX  67.92,16.1 180 top
TX1  51.87,9.7 90 top
TX3  83.21,26.11 90 top
TX5  73.3,8.53 90 top
U1  77.27,13.97 270 top
U2  53.14,18.39 90 top
U4  61.16,10.06 0 top
U5  39.88,16 180 top
U6  82.8,30.18 270 top
U8  75.23,42.16 90 top
U13  35.56,21.08 180 top
U15  67.21,9.96 270 top

### Tracks (layer width: path | path; a pad name or v marks a point on that pad's centre or on a via)
3V  (via drill 0.5)
  Top 0.254: 64.55,10.92 U15.3 | U4.8 60.18,11.75 60.2,11.73 | U4.8 59.08,11.77 R35.2 57.86,12.18 v57.86,12.9 | U4.8 60.18,11.62 | 60.18,11.62 60.15,11.58 | 60.18,11.62 58.76,11.62 58.57,11.43 | R5.2 76.76,4.59 R4.2 | 69.86,8.38 U15.10
  Top 0.305: U15.10 U15.11 67.45,9 67.26,9.2 67.26,10.57 66.9,10.92 64.58,10.92 U15.3 | R4.2 76.71,3.99 v75.56,2.84 | v47.55,2.9 47.55,8.74 v47.83,9.02 | 64.55,10.92 66.02,10.92 66.06,10.97 66.06,11.4 v65.94,11.61
  Bottom 0.254: C13.1 57.4,11.43 57.76,11.79 57.76,12.39 57.76,12.8 v57.86,12.9
  Bottom 0.305: v47.55,2.9 48.31,2.13 73.79,2.13 74.5,2.84 v75.56,2.84 74.95,3.45 72.82,3.45 72.01,4.27 72.01,10.36 70.97,11.4 66.14,11.4 v65.94,11.61 65.84,11.71 | v47.83,9.02 57.35,9.02 57.96,9.63 57.96,12.19 57.76,12.39
+5V  (via drill 0.6)
  Top 0.254: U2.16 50.09,15.45 arc-45 50.01,15.26 v49.84,15.09 | R9.2 R6.2 | R12.2 44.21,5.91 44.04,5.74
  Top 0.305: U13.5 36.51,17.26 v36.07,16.82 35.92,16.66 35.92,7.52 35.97,7.47 38.05,7.47 38.3,7.21 U5.6
  Top 0.406: v75.29,38.91 75.29,38.25 76.03,37.5 U8.7 76.03,35.17 76.45,34.75 79.91,34.75 80.57,35.41 82.04,35.41 82.55,34.9 82.55,32.77 v82.5,32.72 83.13,32.08 U6.8 85.97,32.63 C28.1 | U8.28 75.23,45.97 v75.39,45.82 | v60.66,20.37 61.45,21.17 R1.2 R3.2 71.8,21.17 72.24,20.73 72.24,16.31 72.69,15.85 74.17,15.85 U1.1 74.17,15.9 C6.1 | R6.2 56.63,8.75 57.66,7.57 57.66,7.52 57.64,4.33 JP2.1
  Top 0.61: v41.1,4.06 40.95,4.06 arc45 40.77,3.99 40.69,3.91
  Bottom 0.254: 77.08,45.82 77.08,53.66 78.18,54.76 86.22,54.76 R8.2 | R32.2 81.7,28.85 R33.2 81.65,29.91 81.64,29.92 81.64,30.12 | 81.64,30.58 81.64,30.12 | 81.64,30.12 81.74,30.02 85.24,30.02 85.55,30.33 85.55,31.95 86.31,32.72 89.61,32.72 89.97,33.07 89.97,33.65 R2.2 R7.2
  Bottom 0.305: R8.2 88.89,54.68 JP3.2 | 77.13,44.31 77.17,44.09 | v36.07,16.82 36.07,18.29 36.78,19 37.81,19 C12.1
  Bottom 0.406: v75.29,38.91 73.85,38.91 C2.1 73.75,41.59 74.83,42.67 76.61,42.67 77.17,43.23 77.17,44.09 77.17,45.73 C3.1 77.08,45.82 v75.39,45.82 | R32.2 81.58,31.31 81.58,32.36 81.94,32.72 v82.5,32.72 81.13,32.72 80.72,33.12 C5.1 | 57.51,7.77 58.73,7.77 60.66,9.7 v60.66,20.37 61.45,21.17 62.99,21.17 66.16,24.33 80.77,24.33 81.65,25.21 R33.2 | 57.51,7.77 44.55,7.77 43.79,7.01 42.01,7.01 41.86,7.16 | JP2.1 57.51,7.77
  Bottom 0.61: v41.1,4.06 41.78,4.75 arc45 41.86,4.93 41.86,7.16 41.86,14.28 42.6,15.01 arc-45 42.78,15.09 v49.84,15.09 51.08,16.33 arc-45 51.26,16.41 C7.1
  pour Top: 32.72,7.52 43.79,7.52 44.25,7.06 44.25,3.71 43.89,3.35 32.82,3.35 32.41,3.76 32.41,7.32
+12V  (via drill 0.6)
  Top 1.422: v65.02,41.96 58.88,35.81 56.39,35.81 55.88,35.31
  Top 1.93: 20.07,18.29 19.81,18.54 19.81,26.42 18.54,27.69 16.26,27.69 15.75,28.19 K2.C1 15.75,34.46 D1.C 29.46,36.07 | 29.46,36.07 41.91,36.07 | 41.91,36.07 54.36,36.07 54.99,35.94 | K1.C1 41.91,36.07 | K4.C1 28.96,35.56 29.46,36.07
  Top 2.184: 55.88,35.31 54.99,35.94 56.39,34.8 56.39,32.51 K3.C1
  Bottom 1.422: D1.C 17.36,33.87 15.75,32.26 | 15.75,32.26 15.24,31.75 | K2.C1 15.75,32.26 | D4.C 30.31,33.36 K4.C1 | D2.C 43.77,33.87 K1.C1 | D3.C 58.25,33.87 K3.C1 | v65.02,41.96 66.04,42.98 66.04,60.35 67.06,61.37 69.44,61.37 | 69.44,61.37 79.96,61.37 80.62,62.03 80.62,63.83 JP12.2 | JP11.4 69.39,61.42 69.44,61.37
  pour Top: 12.7,10.67 24.13,10.67 24.13,19.3 15.24,19.3 13.97,18.03 13.97,15.49 12.95,14.48 12.95,10.92
AIR-TOP  (via drill 0.6)
  Top 0.254: R17.1 55.51,26.91 56.08,27.48 58.12,27.48 59.74,29.11 59.74,33.22 60.25,33.73 62.23,33.73 64.97,36.47 67.31,36.47 v67.46,36.32 | v76.91,38.91 76.91,38.15 77.11,37.95 78.44,37.95 79.2,37.19 79.2,36.4 U8.11
  Bottom 0.254: v67.46,36.32 76.45,36.32 76.71,36.58 76.71,38.71 v76.91,38.91
BLUE
  Top 0.305: R23.1 72.08,48.01 U8.32
GND  (via drill 0.5, 0.6)
  other vias: 57.86,21.08 58.12,24.89 50.04,23.16 43.33,12.9 41.2,15.95 23.16,22.66 12.34,3.96 16.41,3.96 62.03,17.68 70.41,32 75.64,33.38 72.75,44.91 69.09,48.41 63.3,45.16 49.23,41.15 32.87,43.03 15.44,38.86 11.84,29.51 83.87,58.17 66.04,63.86 84.94,40.54 79.1,50.39 61.37,6.55 66.24,8.48 66.7,5.38 64.01,14.12 72.03,12.19 46.08,3.76 67.44,12.29 64.44,5.97 69.16,5.51
  pour Bottom: 0,0 74.98,0 74.98,24.33 93.01,24.38 93.98,67.31 0,67.31
  pour Top (rank 6): 0,0 74.98,0 74.98,24.33 93.01,24.38 93.98,67.31 0,67.31
GREEN
  Top 0.305: R25.1 73.98,51.32 72.85,50.19 72.85,47.98 U8.31
HORN
  Top 0.305: R28.1 78.5,51.58 77.83,50.9 77.83,50.24 77.67,50.09 74.32,50.09 73.66,49.43 73.66,47.99 U8.30
IMD-R-SET
  Top 0.813: K2.C2 23.54,32 Q2.3
  Bottom 1.422: D1.A 22.27,33.11 K2.C2
IMD-R-SET1
  Top 0.813: K1.C2 49.53,28.53 Q1.3
  Bottom 1.422: D2.A 48.68,32.85 K1.C2
IMD-R-SET2
  Top 0.813: K3.C2 64.26,28.53 Q3.3
  Bottom 1.422: D3.A 63.16,33.36 K3.C2
IMD-R-SET3
  Top 0.813: K4.C2 36.58,28.28 Q8.3
  Bottom 1.422: D4.A 35.22,33.36 K4.C2
IMD_IN
  Top 0.406: R14.2 42.8,21.34 JP8.1
IMD_STAT  (via drill 0.6)
  Top 0.254: U8.36 68.14,44.56 68.12,44.55 65.13,44.55 58.01,37.44 39.73,37.44 v39.17,38 | v38.51,23.32 38.51,21.37 R14.1
  Top 0.406: JP6.2 31.89,19.75 R15.2 35.05,17.78 35.56,18.29 35.56,21.34 | U13.2 35.56,21.34 | R27.2 R14.1 35.56,21.34
  Bottom 0.254: v39.17,38 39.17,23.98 v38.51,23.32
N$1
  Top 0.305: R10.1 85.73,55.58 LED1.A
N$2
  Top 0.254: U8.22 82.18,46.16 82.55,46.53 82.55,48.92 82.86,49.23 R10.2
N$3
  Top 0.406: U1.8 82.12,15.88 83.01,16.76 83.01,17.88 83.97,18.85 87.86,18.85 JP1.1
  Bottom 0.813: C4.A 82.93,15.37 83.21,15.65 | 83.21,15.65 83.52,15.95 83.52,18.39 84.18,19.05 JP1.1 | C1.1 83.62,15.24 83.21,15.65
N$4
  Top 0.254: U1.7 84.45,14.61 86.36,16.51 JP1.2
N$5
  Top 0.254: U1.6 89.97,13.33 JP1.3
N$6
  Top 0.305: U1.5 89.71,12.06 JP1.4
  Bottom 0.254: C4.C 80.82,11.89 81.28,11.43
  Bottom 0.813: C4.C 82.82,12.07 C1.2 83.62,12.8 84.68,11.73 87.5,11.73 JP1.4
N$7
  Top 0.254: R1.1 TX.A
N$8
  Top 0.254: R3.1 RX.A
N$9
  Top 0.254: TX5.A 76.05,8.53 76.71,7.87 R4.1
N$10
  Top 0.254: RX5.A 75.07,10.46 R5.1
N$11
  Top 0.254: TX1.A R6.1
N$12
  Top 0.254: RX1.A R9.1
N$13
  Bottom 2.54: K2.COM 17.02,42.16
  Bottom 3.81: 17.02,42.16 22.1,42.16 25.15,45.21 25.15,48.26 26.67,49.78 K4.N.O K1.N.O 56.39,49.78 K3.N.O
N$14
  Top 0.406: Q2.1 27.69,26.48 R16.2 29.46,26.53 R13.2
N$15
  Top 0.406: Q8.1 40.59,27.24 R31.2 40.64,25.77 R30.2
N$16  (via drill 0.6)
  Top 0.406: v29.97,8.13 U5.4
  Bottom 0.406: R11.2 30.23,8.38 v29.97,8.13
N$17
  Bottom 2.184: J8.1 11.43,35.05 12.7,36.32 12.7,45.47 13.46,46.23 18.03,46.23 19.81,48.01 19.81,54.36 J9.2
N$18
  Bottom 2.184: J7.1 J8.2
N$19
  Top 0.254: LED2.A 45.21,7.96 R12.1
N$20
  Top 3.81: J4.1 54.86,56.39 52.83,54.36 52.83,46.23 K3.COM
N$21
  Top 0.406: Q4.1 68.7,55.07 R22.2 67.92,55.02 67.56,54.66 R21.2
N$22
  Top 3.81: K4.COM 28.45,42.16 25.65,44.96 25.65,55.63 26.42,56.39 J6.1
N$23
  Top 0.406: Q1.1 53.54,27.5 R18.2 53.59,25.77 R17.2
N$24
  Top 0.406: Q3.1 68.28,27.5 R20.2 68.33,26.05 R19.2
N$25
  Top 0.406: Q5.1 72.76,55.07 R24.2 72.24,55.02 72.03,54.81 72.03,53.43 R23.2
N$26
  Top 0.406: Q6.1 76.57,55.07 R26.2 76.62,54.88 76.25,54.51 76.25,53.17 R25.2
N$27
  Top 0.406: Q7.1 80.58,55.02 R29.2 80.63,53.67 R28.2
N$28
  Top 0.61: JP11.3 71.93,61.45 Q4.3
N$29
  Top 0.61: JP11.2 74.47,59.93 Q5.3
N$30
  Top 0.61: JP11.1 77.01,59.67 Q6.3
N$31
  Top 0.406: U13.4 34.61,20.51 34.29,20.83 32.06,20.83 JP6.1 30.28,20.77 29.72,21.34 29.72,24.5 R13.1
N$32
  Top 0.406: LED9.A 40.17,19.45 R27.1
N$33
  Top 0.813: JP12.1 83.39,60.97 Q7.3
N$34
  Top 3.81: J5.1 39.62,56.39 38.35,55.12 38.35,45.72 K1.COM
N$35  (via drill 0.6)
  Top 0.254: v85.95,26.16 84.31,26.16 TX3.A
  Bottom 0.254: R33.1 83.65,26.72 TX3.A 85.9,26.11 v85.95,26.16
N$36
  Top 0.254: U15.7 63.84,8.37 63.55,8.08 63.55,5.99 63.09,5.54 61.52,5.54 60.96,4.98 60.96,2.39 61.37,2.13 72.34,2.13 72.8,2.59 72.8,3
  Top 0.305: 72.8,3 72.8,6.17 72.21,6.76 72.21,8.49 TX5.C
N$37  (via drill 0.6)
  Top 0.254: v83.52,35.61 83.52,33.97 RX3.A
  Bottom 0.254: R32.1 83.7,35.42 v83.52,35.61
N$38
  Top 0.254: U15.14 71.08,10.91 71.58,10.41 72.25,10.41 RX5.C
N$39
  Top 0.254: 64.55,10.26 U15.4 61.53,10.27 60.81,9.55 60.81,8.38 U4.2
N$40
  Top 0.254: U8.17 82.55,42.16 83.46,43.08 83.46,46.84 84.38,47.75 87.58,47.75 JP3.4
N$41  (via drill 0.5)
  Top 0.254: U4.3 61.49,9.32 61.87,9.7 62.99,9.7 63.2,9.45 v63.2,9.04
  Top 0.305: U15.1 63.56,12.18 63.45,12.29 v63.45,12.95 63.45,13.06
  Bottom 0.254: v63.2,9.04 63.2,12.7 v63.45,12.95
N$42
  Top 0.254: JP4.3 67.97,7.42 68.22,7.67 69.79,7.67 U15.9
N$43
  Top 0.254: U8.16 82.61,41.36 84.23,42.98 84.23,46.28 84.73,46.79 JP3.5
N$44
  Bottom 2.184: K2.N.O 15.75,50.04 11.68,54.1 J7.2
N$45
  Top 3.81: J1.2 16.26,23.37 D5.A
N$46  (via drill 0.5)
  Top 0.254: v79.45,42.98 81.02,42.98 U8.18
  Bottom 0.254: JP3.1 90.98,56.95 91.39,56.54 91.39,53.65 90.93,53.19 84.94,53.19 84.18,52.43 84.18,43.99 83.21,43.03 79.65,43.03 v79.45,42.98
  Bottom 0.305: R8.1 88.94,56.48 JP3.1
N$54
  Top 0.254: JP4.2 65.43,6.87 U15.8
N$62
  Top 0.305: SJ2.2 67.31,13.77 68.83,12.24 69.79,12.24 U15.16
N$69
  Top 0.254: 60.86,12.24 60.83,12.27 U4.7 60.83,10.44 60.35,9.96 59.27,9.96 R35.1
N$85
  Top 0.254: U15.12 69.94,9.64 70,9.7
  Top 0.305: U15.12 70.7,9.64 70.99,9.35 70.99,4.17 JP4.4
  Bottom 0.61: C14.A C17.1 70.1,6.81 70.46,6.45 70.46,3.73 JP4.4
POWER  (via drill 0.6)
  Top 0.254: R19.1 69.99,30.49 68.17,32.31 68.17,33.99 67.87,34.29 66.34,34.29 v66.14,34.09 | v67.61,39.17 67.82,38.96 U8.43
  Bottom 0.254: v66.14,34.09 66.14,38.41 66.6,38.81 67.26,38.81 v67.61,39.17
PRE&HV-  (via drill 0.6)
  Top 0.254: U8.14 80.53,39.76 | 80.53,39.76 80.52,39.78 | 80.53,39.76 79.97,39.76 79.76,39.98 79.76,40.54 78.84,41.45 72.85,41.45 72.64,41.66 v72.64,42.82 | v66.55,40.69 66.55,39.83 61.87,35.15 59.74,35.15 58.42,33.83 58.42,31.04 57.91,30.53 52.78,30.53 52.32,30.99 52.32,33.73 51.82,34.24 46.89,34.24 45.62,32.97 45.62,26.52 44.6,25.5 42.71,25.5 R30.1
  Bottom 0.254: v72.64,42.82 72.64,41.91 72.44,41.71 67.56,41.71 v66.55,40.69
RS-A
  Top 0.254: U6.6 89.05,29.54 JP7.2
  Bottom 0.254: R34.1 89.62,28.97 JP7.2
RS-B
  Top 0.254: U6.7 89.71,30.81 JP7.1
  Bottom 0.254: R34.2 89.88,30.97 JP7.1
RX1
  Top 0.254: U8.1 69.18,36.36 arc45 69,36.29 67.92,35.2 64.72,35.2 arc45 64.54,35.13 62.59,33.17 60.71,33.17 arc45 60.53,33.1 60.35,32.92 60.35,28.96 arc-45 60.28,28.78 58.42,26.92 57.1,26.92 arc45 56.92,26.85 56.49,26.42 56.49,24.9 arc-45 56.41,24.72 55.37,23.67 55.37,22.05 arc-45 55.3,21.87 54.41,20.98 54.41,17.94 arc45 54.48,17.76 54.76,17.47 55.96,17.47 arc-45 U2.3
RX2
  Top 0.254: RX3.C 80.62,34.14 79.81,33.43 79.81,32.46 U6.1 80.16,32.05 75.18,32.05 74.44,32.8 U8.5
RX_POWER
  Top 0.254: U2.1 69.84,16.16 arc-45 70.02,16.09 70.21,15.9 RX.C arc-45 70.26,15.03 70.71,14.58 74.13,14.58 arc45 U1.2
RX_SCREEN  (via drill 0.6)
  Top 0.254: v49.23,11.73 49.56,11.81 arc-45 49.74,11.89 RX1.C 51.66,11.89 51.87,11.68 51.87,7.52 53.03,6.35 54.46,6.35 55.02,5.79 55.02,4.5 JP2.2 | v58.12,19.61 58.12,19.26 arc-45 58.04,19.08 57.71,18.75 56.03,18.75 arc-45 U2.5
  Bottom 0.254: v58.12,19.61 58.09,19.58 arc45 58.01,19.4 58.01,14.02 57.94,13.94 arc-45 57.76,13.87 49.84,13.87 49.23,13.26 v49.23,11.73
S0  (via drill 0.6)
  Top 0.254: U8.24 78.44,49.07 78.74,49.38 80.67,49.38 v80.82,49.53 | U2.10 | v53.59,23.62 53.39,23.62 53.14,23.37 53.14,21.49 51.71,20.07 U2.10 | 50.14,20.12 U2.10
  Bottom 0.254: v80.82,49.53 80.21,49.53 79.91,49.23 79.91,44.91 79.4,44.4 78.18,44.4 77.88,44.09 77.88,26.77 76.56,25.45 64.77,25.45 62.23,22.91 54.3,22.91 v53.59,23.62
S1  (via drill 0.6)
  Top 0.254: U8.23 80.93,47.96 v81.18,48.21 | U2.9 51.5,20.71 51.77,20.98 51.77,22.15 v51.97,22.35
  Bottom 0.254: v81.18,48.21 80.92,47.96 80.62,47.96 80.42,47.75 80.42,44.6 79.7,43.89 78.69,43.89 78.44,43.64 78.44,26.62 76.76,24.94 65.02,24.94 62.43,22.35 v51.97,22.35
SCL
  Top 0.203: 79.15,38.56 80.31,37.44
  Top 0.254: U8.37 70.74,43.76 71.22,43.28 71.22,41.3 71.78,40.74 78.38,40.74 79.15,39.98 79.15,38.56 | 80.31,37.44 86.61,37.44 86.92,37.69 86.92,40.28 87.58,40.95 JP5.2
  Bottom 0.254: R7.1 87.22,36.02 86.92,36.32 86.92,40.44 87.43,40.95 JP5.2
SDA
  Top 0.203: 78.38,38.66 80.19,36.86
  Top 0.254: U8.42 70.6,39.76 71.07,40.23 78.13,40.23 78.38,39.98 78.38,38.66 | 80.19,36.86 88.77,36.86 89,37.34 89,38.28 JP5.1
  Bottom 0.254: JP5.1 89.13,37.77 89.05,37.69 89,37.69 89,34.19 88.8,33.99 R2.1
TX1
  Top 0.254: U8.44 65.7,38.16 62.08,34.44 59.89,34.44 59.08,33.68 59.08,29.26 58.01,28.19 55.73,28.19 54.71,27.18 54.71,22.2 51.82,19.3 51.82,18.49 51.46,18.14 50.11,18.14 U2.13 50.12,18.09
TX2
  Top 0.254: TX3.C 80.26,26.11 80.06,26.31 80.06,28.14 U6.4 80.16,28.3 74.83,28.3 73.64,29.49 U8.4
TX_POWER  (via drill 0.6)
  Top 0.254: U1.3 68.66,13.33 arc-45 68.48,13.41 67.92,13.97 TX.C 54.9,15.05 arc-45 54.72,15.13 53.31,16.54 arc-45 53.24,16.72 v53.24,18.75 | v48.21,18.8 50.01,18.8 arc-45 U2.12
  Bottom 0.254: v53.24,18.75 48.33,18.75 arc-45 v48.21,18.8
TX_SCREEN
  Top 0.254: U2.14 48.81,17.46 arc45 48.63,17.39 48.36,17.12 48.36,9.91 48.56,9.7 TX1.C 50.82,7.45 52.48,5.79 52.48,4.24 JP2.3
U6-RE/DE
  Top 0.254: U8.2 72.03,35.36 73.05,34.34 73.05,29.21 74.62,27.63 78.33,27.63 78.94,27.03 78.94,25.35 79.5,24.79 82.91,24.79 83.26,25.15 83.26,29.21 82.91,29.57 80.21,29.57 U6.3 U6.2
USBRX  (via drill 0.5)
  Top 0.254: U2.2 58.88,16.82 59.33,17.27 v59.33,17.63 | U4.6 61.49,13.54 61.32,13.72 59.64,13.72 59.33,13.41 v59.33,13.21
  Bottom 0.254: v59.33,13.21 v59.33,17.63
USBTX
  Top 0.254: U2.15 51.91,16.82 arc-45 52.09,16.74 54.51,14.33 61.77,14.33 62.13,13.97 62.13,12.41 U4.5
YELLOW
  Top 0.305: R21.1 67.22,51.58 67.06,51.41 67.06,46.28 67.92,45.42 69.38,45.42 U8.35

### Text on the board
_tsilk: 1 | 1 | 1 | 1 | Q4 | Q5 | Q6 | Q7 | JP3 | R22 | R24 | R26 | + | R25 | R21 | R23 | R29 | R28 | LED1 | R10 | 1 | U8 | RX3 | C28 | 1 | K3 | U6 | K4 | R31 | R18 | R20 | K2 | K1 | Q1 | Q3 | Q8 | R30 | R17 | R19 | TX3 | Q2 | R13 | R16 | U2 | U13 | C6 | C11 | JP6 | R1 | R3 | R15 | R14 | 1 | U5 | R27 | TX | RX | U1 | D5 | LED9 | SJ2 | RX1 | U15 | R9 | LED2 | RX5 | TX1 | TX5 | R6 | R4 | R5 | R12 | R35
_bsilk: R8 | C2 | C5 | R7 | D4 | D2 | D3 | R2 | D1 | R32 | R33 | R34 | C12 | C7 | C4 | C1 | C13 | R11 | C17 | C14